# EAGLE design Temperature Control LAB (EAGLE 9.6.2)
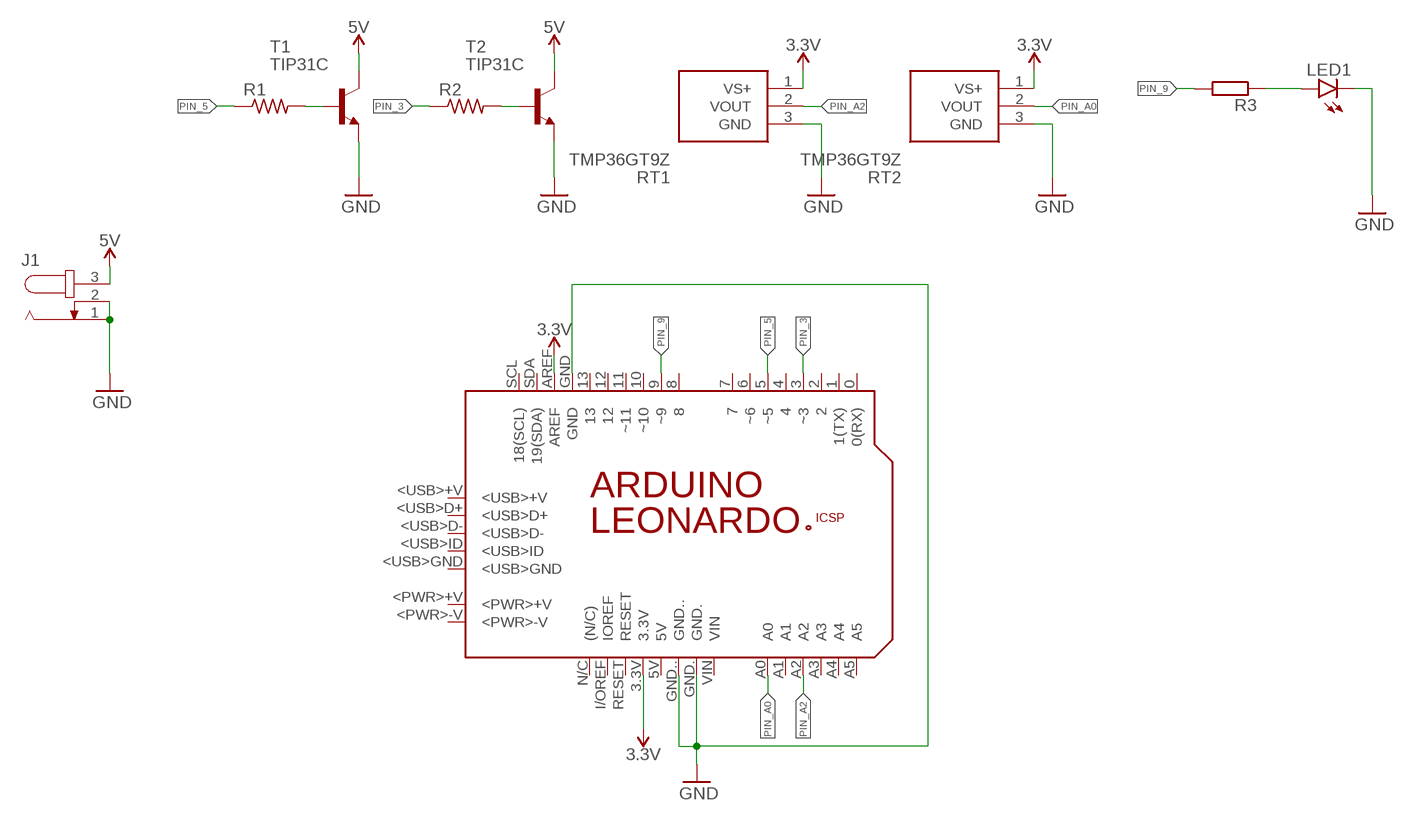
[diagram p0: schematic, sheet 1]

## Parts
J1  JACK-PLUG0  [SPC4077]
LED1  LED5MM  [LED5MM]
PCB1  ARDUINO_LEONARDO  [ARDUINO_LEONARDO]
R1  R-US_M0805  [M0805]
R2  R-US_M0805  [M0805]
R3  R-EU_R0805  [R0805]
RT1  TMP36GT9Z  [TO-92]
RT2  TMP36GT9Z  [TO-92]
T1  TIP31C  [TO220]
T2  TIP31C  [TO220]

## Nets
3.3V: PCB1.3.3V PCB1.AREF RT1.1(VS+) RT2.1(VS+)
5V: J1.3 T1.2(C) T2.2(C)
GND: J1.1 J1.2 LED1.K(C) PCB1.GND PCB1.GND. PCB1.GND.. RT1.3(GND) RT2.3(GND) T1.3(E) T2.3(E)
N$1: R1.2 T1.1(B)
N$2: R2.2 T2.1(B)
N$3: LED1.A R3.1
PIN_3: PCB1.3(~3) R2.1
PIN_5: PCB1.5(~5) R1.1
PIN_9: PCB1.9(~9) R3.2
PIN_A0: PCB1.A0 RT2.2(VOUT)
PIN_A2: PCB1.A2 RT1.2(VOUT)
Unconnected: PCB1.0(0(RX)) PCB1.1(1(TX)) PCB1.2 PCB1.4 PCB1.5V PCB1.6(~6) PCB1.7 PCB1.8 PCB1.10(~10) PCB1.11(~11) PCB1.12 PCB1.13 PCB1.+5V PCB1.<PWR>+V PCB1.<PWR>-V PCB1.<USB>+V PCB1.<USB>D+ PCB1.<USB>D- PCB1.<USB>GND PCB1.<USB>ID PCB1.A1 PCB1.A3 PCB1.A4 PCB1.A5 PCB1.GND_ PCB1.I/OREF(IOREF) PCB1.MISO PCB1.MOSI PCB1.N/C((N/C)) PCB1.RESET PCB1.RESET. PCB1.SCK PCB1.SCL(18(SCL)) PCB1.SDA(19(SDA)) PCB1.VIN

## Library data of the parts
J1 = con-jack:JACK-PLUG: DC POWER JACK Power Jack, DC, Right Angle, Through Hole, Rated 5A at 16VDC, PC Terminals Distributor: Farnell (www.Farnell.de) Drawing: 84N1161.pdf / 84N1162.pdf Manufacturer: SPC Technology (www.spctechnology.com) Type: SPC4077 / SPC 4078; OC_FARNELL: unknown; OC_NEWARK: unknown
LED1 = led:LED: LED OSRAM: - CHIPLED LG R971, LG N971, LY N971, LG Q971, LY Q971, LO R971, LY R971 LH N974, LH R974 LS Q976, LO Q976, LY Q976 LO Q996 - Hyper CHIPLED LW Q18S LB Q993, LB Q99A, LB R99A - SideLED LS A670, LO A670, LY A670, LG A670, LP A670 LB A673, LV A673, LT A673, LW A673 LH A674 LY A675 LS A676, LA A676, LO A676, LY A676, LW A676 LS A679, LY A679, LG A679 - Hyper Micro SIDELED® LS Y876, LA Y876, LO Y876, LY Y876 LT Y87S - SmartLED LW L88C, LW L88S LB L89C, LB L89S, LG L890 LS L89K, LO L89K, LY L89K LS L896, LA L896, LO L896, LY L896 - TOPLED LS T670, LO T670, LY T670, LG T670, LP T670 LSG T670, LSP T670, LSY T670, LOP T670, LYG T670 LG T671, LOG T671, LSG T671 LB T673, LV T673, LT T673, LW T673 LH T674 LS T676, LA T676, LO T676, LY T676, LB T676, LH T676, LSB T676, LW T676 LB T67C, LV T67C, LT T67C, LS T67K, LO T67K, LY T67K, LW E67C LS E67B, LA E67B, LO E67B, LY E67B, LB E67C, LV E67C, LT E67C LW T67C LS T679, LY T679, LG T679 LS T770, LO T770, LY T770, LG T770, LP T770 LB T773, LV T773, LT T773, LW T773 LH T774 LS E675, LA E675, LY E675, LS T675 LS T776, LA T776, LO T776, LY T776, LB T776 LHGB T686 LT T68C, LB T68C - Hyper Mini TOPLED® LB M676 - Mini TOPLED Santana® LG M470 LS M47K, LO M47K, LY M47K Source: http://www.osram.convergy.de LUXEON: - LUMILED® LXK2-PW12-R00, LXK2-PW12-S00, LXK2-PW14-U00, LXK2-PW14-V00 LXK2-PM12-R00, LXK2-PM12-S00, LXK2-PM14-U00 LXK2-PE12-Q00, LXK2-PE12-R00, LXK2-PE12-S00, LXK2-PE14-T00, LXK2-PE14-U00 LXK2-PB12-K00, LXK2-PB12-L00, LXK2-PB12-M00, LXK2-PB14-N00, LXK2-PB14-P00, LXK2-PB14-Q00 LXK2-PR12-L00, LXK2-PR12-M00, LXK2-PR14-Q00, LXK2-PR14-R00 LXK2-PD12-Q00, LXK2-PD12-R00, LXK2-PD12-S00 LXK2-PH12-R00, LXK2-PH12-S00 LXK2-PL12-P00, LXK2-PL12-Q00, LXK2-PL12-R00 Source: www.luxeon.com KINGBRIGHT: KA-3528ASYC Source: www.kingbright.com
PCB1 = E14_Arduino_revC:ARDUINO_LEONARDO: Device for representing an Arduino Leonardo board with a footprint in an EAGLE design. Created by Dave Young for Element14. More EAGLE documentation at: http://www.element14.com/community/community/knode/cadsoft_eagle
R1 R2 = rcl:R-US_: RESISTOR, American symbol; SPICEPREFIX: R
R3 = rcl:R-EU_: RESISTOR, European symbol; SPICEPREFIX: R
RT1 RT2 = TMP36GT9Z:TMP36GT9Z: TMP36GT9Z, Temperature Sensor +/-3C Serial-2 Wire 2.7 5.5 V 3-Pin TO-92 Source: Datasheet <https://datasheet.datasheetarchive.com/originals/distributors/SFDatasheet-4/sf-00085637.pdf>; DESCRIPTION: TMP36GT9Z, Temperature Sensor +/-3C Serial-2 Wire 2.7 5.5 V 3-Pin TO-92; HEIGHT: mm; MANUFACTURER_NAME: Analog Devices; MANUFACTURER_PART_NUMBER: TMP36GT9Z; MOUSER_PART_NUMBER: 584-TMP36GT9Z; MOUSER_PRICE-STOCK: https://www.mouser.co.uk/ProductDetail/Analog-Devices/TMP36GT9Z?qs=WIvQP4zGanhT97N47MSoHw%3D%3D
T1 T2 = TIP31C:TIP31C: NPN TRANSISTOR Check availability <https://pricing.snapeda.com/parts/TIP31C/STMicroelectronics/view-part?ref=eda>; AVAILABILITY: In Stock; CHECK_PRICES: https://www.snapeda.com/parts/TIP31C/STMicroelectronics/view-part/?ref=eda; DESCRIPTION: Bipolar (BJT) Transistor NPN 100 V 3 A - 2 W Through Hole TO-220; MF: STMicroelectronics; MP: TIP31C; PACKAGE: Package; PRICE: None; PURCHASE-URL: https://www.snapeda.com/api/url_track_click_mouser/?unipart_id=4792338&manufacturer=STMicroelectronics&part_name=TIP31C&search_term=None; SNAPEDA_LINK: https://www.snapeda.com/parts/TIP31C/STMicroelectronics/view-part/?ref=snap

## Board
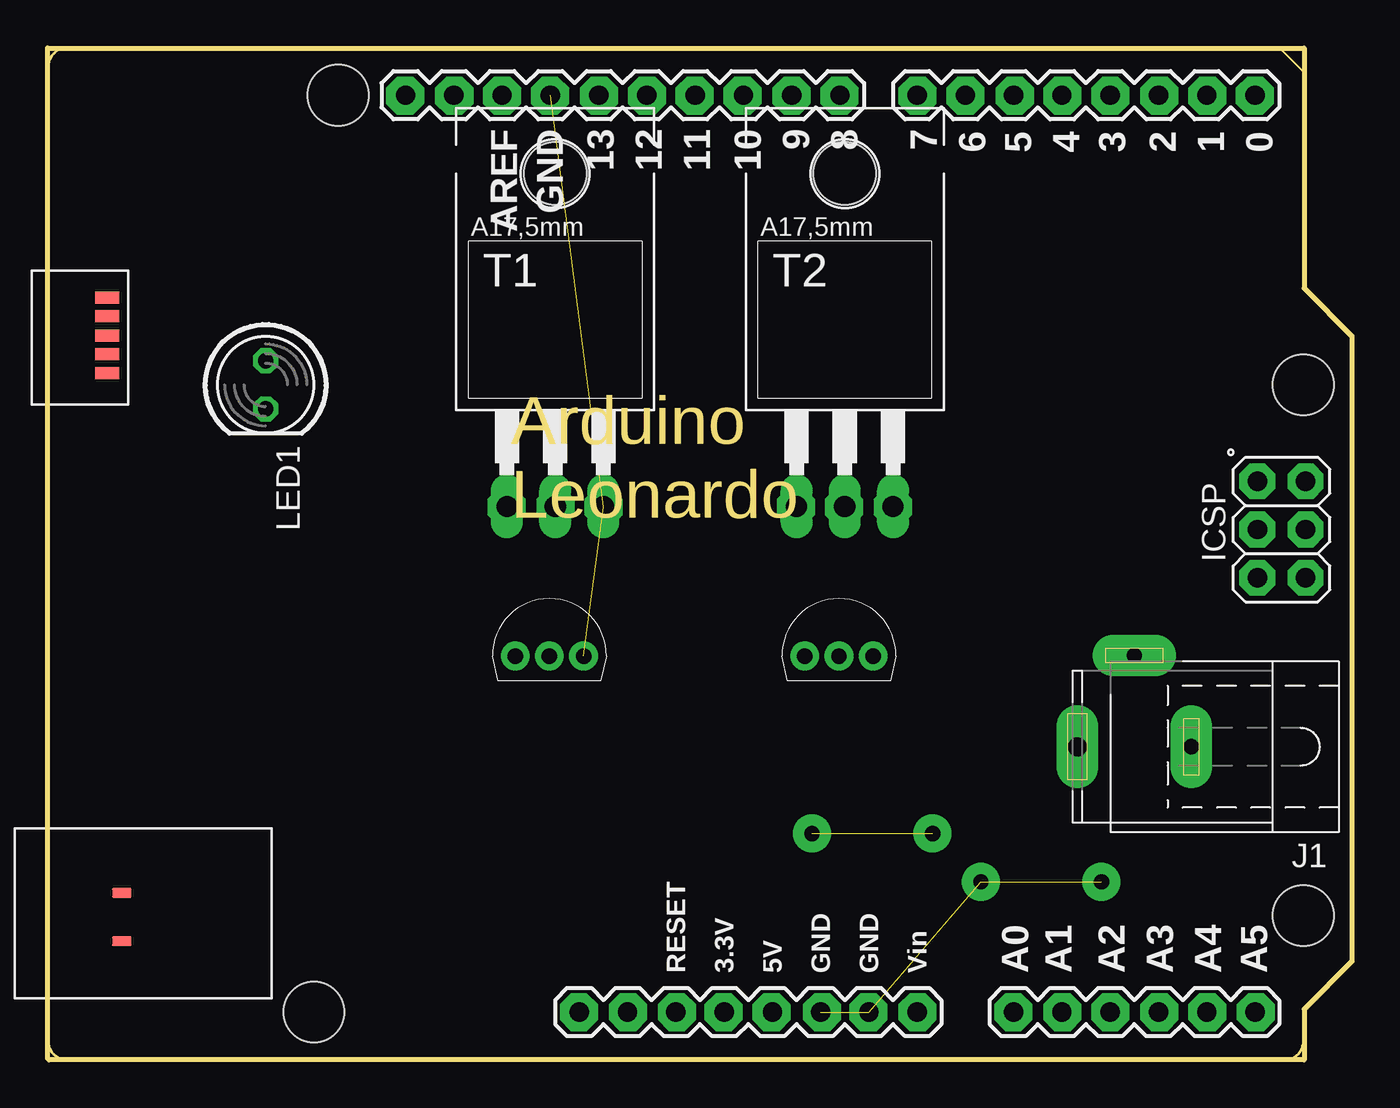
[diagram p1: board, top side]
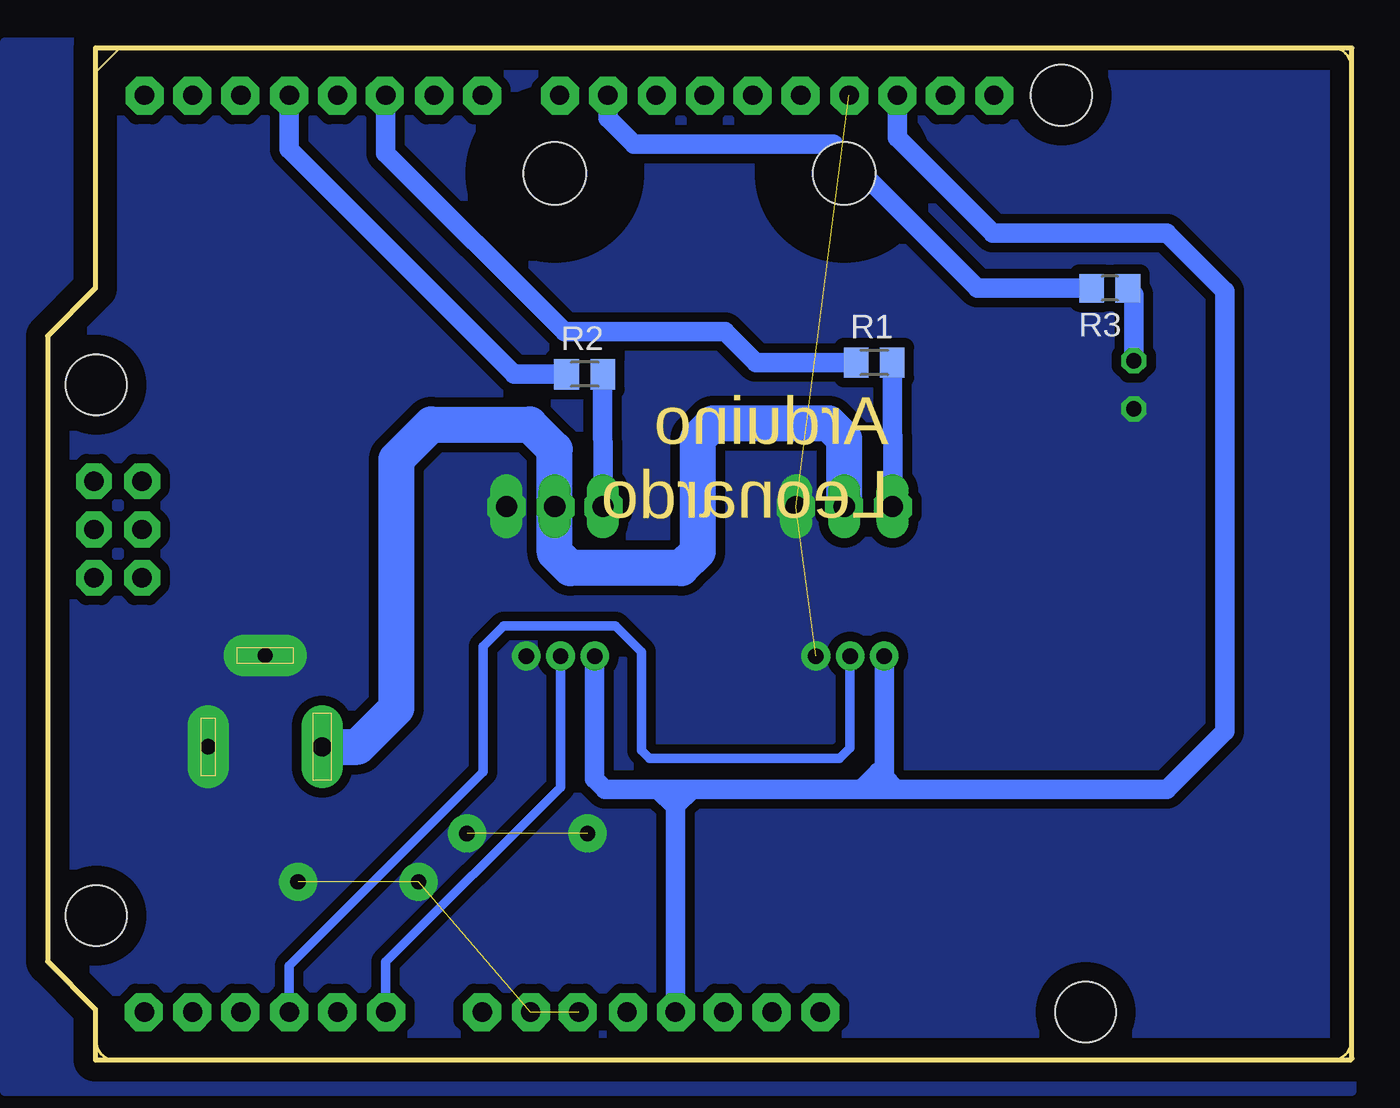
[diagram p2: board, bottom side, seen from below]

Size 68.66 x 53.31 mm. Coordinates in mm from the lower left corner, seen from the top.
Outline: 0,53.29 66.14,53.29 66.14,40.64 68.66,38.12 68.66,5.21 66.14,2.69 66.14,0.02 0.08,0.02 0,0.1 0,53.29
Copper layers (1*16): Top 0.035mm / dielectric 1.5mm / Bottom 0.035mm
Design rules "default": minimum track width 6mil, minimum drill 0.35mm, track to track 6mil, track to pad 6mil, pad to pad 6mil, via to via 6mil, smd to smd 6mil, copper to edge 40mil, drill to drill 6mil, minimum pad ring 10mil, minimum via ring 8mil, stop-mask expansion 4mil, vias tented up to drill 0mil, thermal gap 10mil

### Footprints (pad centres in the part's own frame; a part is rotated, then mirrored left to right if it is on the bottom)
SPC4077 = drill 0.8 pad 2.184 long: 1 -3,0; 2 0,-4.8 | drill 1 pad 2.184 long: 3 3,0
LED5MM = drill 0.813 octagon: A -1.27,0; K 1.27,0
ARDUINO_LEONARDO = drill 1.016 pad 1.88: 0 63.5,50.8; 1 60.96,50.8; 2 58.42,50.8; 3 55.88,50.8; 3.3V 35.56,2.54; 4 53.34,50.8; 5 50.8,50.8; 5V 38.1,2.54; 6 48.26,50.8; 7 45.72,50.8; 8 41.656,50.8; 9 39.116,50.8; 10 36.576,50.8; 11 34.036,50.8; 12 31.496,50.8; 13 28.956,50.8; A0 50.8,2.54; A1 53.34,2.54; A2 55.88,2.54; A3 58.42,2.54; A4 60.96,2.54; A5 63.5,2.54; AREF 23.876,50.8; GND 26.416,50.8; GND. 43.18,2.54; GND.. 40.64,2.54; I/OREF 30.48,2.54; N/C 27.94,2.54; RESET 33.02,2.54; SCL 18.796,50.8; SDA 21.336,50.8; VIN 45.72,2.54 | drill 1.016 pad 1.88 octagon: +5V 66.167,30.48; GND_ 66.167,25.4; MISO 63.627,30.48; MOSI 66.167,27.94; RESET. 63.627,25.4; SCK 63.627,27.94 | smd 1.016 x 0.508: <PWR>+V 3.861,8.814; <PWR>-V 3.861,6.274 | smd 1.27 x 0.635: <USB>+V 3.099,40.157; <USB>D+ 3.099,39.167; <USB>D- 3.099,38.151; <USB>GND 3.099,36.17; <USB>ID 3.099,37.186 | hole 3.2: 66.04,7.62; 66.04,35.56; 15.24,50.8; 13.97,2.54
M0805 = smd 1.3 x 1.6: 1 -0.95,0; 2 0.95,0
R0805 = smd 1.3 x 1.5: 1 -0.95,0; 2 0.95,0
TO-92 = drill 0.81 pad 1.51: 1 0,-1.8; 2 0,0; 3 0,1.8
TO220 = drill 1.118 long: 1 -2.54,-6.35; 2 0,-6.35; 3 2.54,-6.35 | hole 3.302: 0,11.176

### Placement (x,y rotation side)
J1  57.2,16.51 180 top
LED1  11.48,35.56 270 top
PCB1  0.05,0 0 top
R1  25.15,36.73 0 bottom
R2  40.39,36.12 0 bottom
R3  12.75,40.64 180 bottom
RT1  26.42,21.29 270 top
RT2  41.66,21.29 270 top
T1  26.72,35.51 0 top
T2  41.96,35.51 0 top

### Tracks (layer width: path | path; a pad name or v marks a point on that pad's centre or on a via)
3.3V  (via drill 0.8 pad 2)
  Bottom 1.016: PCB1.AREF v23.93,50.78 23.93,48.56 18.9,43.54 9.75,43.54 6.71,40.49 6.71,17.32 9.75,14.27 24.08,14.27 | PCB1.3.3V 35.61,13.36 | 35.61,13.41 35.61,14.27 | 36.53,14.27 39.32,14.27 39.86,14.81 RT2.1 | 36.53,14.27 35.61,14.27 | 35.61,14.27 34.75,14.27 | 34.75,14.27 25.84,14.27 | 25.84,14.27 24.69,14.27 | 24.69,14.27 24.08,14.27 | RT1.1 24.62,14.88 | 24.92,15.19 24.92,14.51 24.69,14.27 | 24.92,15.19 25.84,14.27 | 24.92,15.19 24.62,14.88 | 24.62,14.88 24.08,14.35 24.08,14.27 | 35.61,13.36 36.53,14.27 | 35.61,13.36 35.61,13.41 | 35.61,13.41 34.75,14.27
5V
  Bottom 1.905: J1.3 52.32,16.51 50.29,18.54 50.29,31.65 48.46,33.48 43.28,33.48 41.96,32.16 T2.2 41.96,26.72 41.15,25.91 35.31,25.91 34.44,26.77 34.44,32.72 33.63,33.53 29.46,33.53 27.53,33.53 26.72,32.72 T1.2
GND  (via drill 0.8 pad 2)  (7 unrouted)
  other vias: 40.23,11.94 46.58,11.94 49.12,9.4 55.47,9.4 29.26,29.13 44.5,29.13
  pour Bottom (isolate 0.5, no thermals): 0,53.59 70.92,53.59 70.92,-1.63 0,-1.63
N$1
  Bottom 1.016: R1.2 24.17,29.17 T1.1
N$2
  Bottom 1.016: R2.2 T2.1
N$3
  Bottom 1.016: R3.1 11.48,40.32 LED1.A
N$4  (via drill 0.8 pad 2)
  other vias: 18.82,50.77
N$5  (via drill 0.8 pad 2)
  other vias: 26.75,29.13
N$6  (via drill 0.8 pad 2)
  other vias: 24.16,29.13
N$7  (via drill 0.8 pad 2)
  other vias: 41.91,29.13
N$8  (via drill 0.8 pad 2)
  other vias: 39.4,29.13
N$9  (via drill 0.8 pad 2)
  other vias: 21.41,50.77
N$10  (via drill 0.8 pad 2)
  other vias: 26.44,50.77
N$11  (via drill 0.8 pad 2)
  other vias: 29.03,50.77
N$12  (via drill 0.8 pad 2)
  other vias: 31.55,50.77
N$13  (via drill 0.8 pad 2)
  other vias: 34.06,50.77
N$14  (via drill 0.8 pad 2)
  other vias: 36.58,50.77
N$15  (via drill 0.8 pad 2)
  other vias: 41.68,50.77
N$16  (via drill 0.8 pad 2)
  other vias: 45.8,50.77
N$17  (via drill 0.8 pad 2)
  other vias: 48.31,50.77
N$18  (via drill 0.8 pad 2)
  other vias: 50.9,50.77
N$19  (via drill 0.8 pad 2)
  other vias: 53.42,50.77
N$20  (via drill 0.8 pad 2)
  other vias: 58.52,50.77
N$21  (via drill 0.8 pad 2)
  other vias: 61.04,50.77
N$22  (via drill 0.8 pad 2)
  other vias: 63.55,50.77
N$23  (via drill 0.8 pad 2)
  other vias: 27.97,2.54
N$24  (via drill 0.8 pad 2)
  other vias: 30.56,2.54
N$25  (via drill 0.8 pad 2)
  other vias: 33.12,2.54
N$26  (via drill 0.8 pad 2)
  other vias: 35.59,2.54
N$27  (via drill 0.8 pad 2)
  other vias: 38.1,2.54
N$28  (via drill 0.8 pad 2)
  other vias: 40.77,2.54
N$29  (via drill 0.8 pad 2)
  other vias: 43.21,2.54
N$30  (via drill 0.8 pad 2)
  other vias: 45.8,2.54
N$31  (via drill 0.8 pad 2)
  other vias: 50.83,2.54
N$32  (via drill 0.8 pad 2)
  other vias: 53.42,2.54
N$33  (via drill 0.8 pad 2)
  other vias: 58.52,2.54
N$34  (via drill 0.8 pad 2)
  other vias: 61.04,2.54
N$35  (via drill 0.8 pad 2)
  other vias: 63.6,2.54
PIN_3  (via drill 0.8 pad 2)
  Bottom 1.016: R2.1 44.09,36.12 55.93,47.95 v55.93,50.78 PCB1.3
PIN_5
  Bottom 1.016: R1.1 31.38,36.73 33,38.35 41.45,38.35 50.85,47.75 PCB1.5
PIN_9  (via drill 0.8 pad 2)
  Bottom 1.016: R3.2 19.71,40.64 27.29,48.22 37.78,48.22 39.17,49.61 v39.17,50.78 PCB1.9
PIN_A0
  Bottom 0.5: RT2.2 41.66,14.38 50.85,5.18 PCB1.A0
PIN_A2  (via drill 0.8 pad 2)
  Bottom 0.5: PCB1.A2 55.93,4.98 45.72,15.19 45.72,21.79 44.65,22.86
  Bottom 0.508: RT1.2 26.42,16.46 26.97,15.9 36.98,15.9 37.39,16.31 37.39,21.49 38.76,22.86 44.65,22.86
  other vias: 55.93,2.54